# EAGLE schematic boosterpack-can-iso (EAGLE 7.6.0)
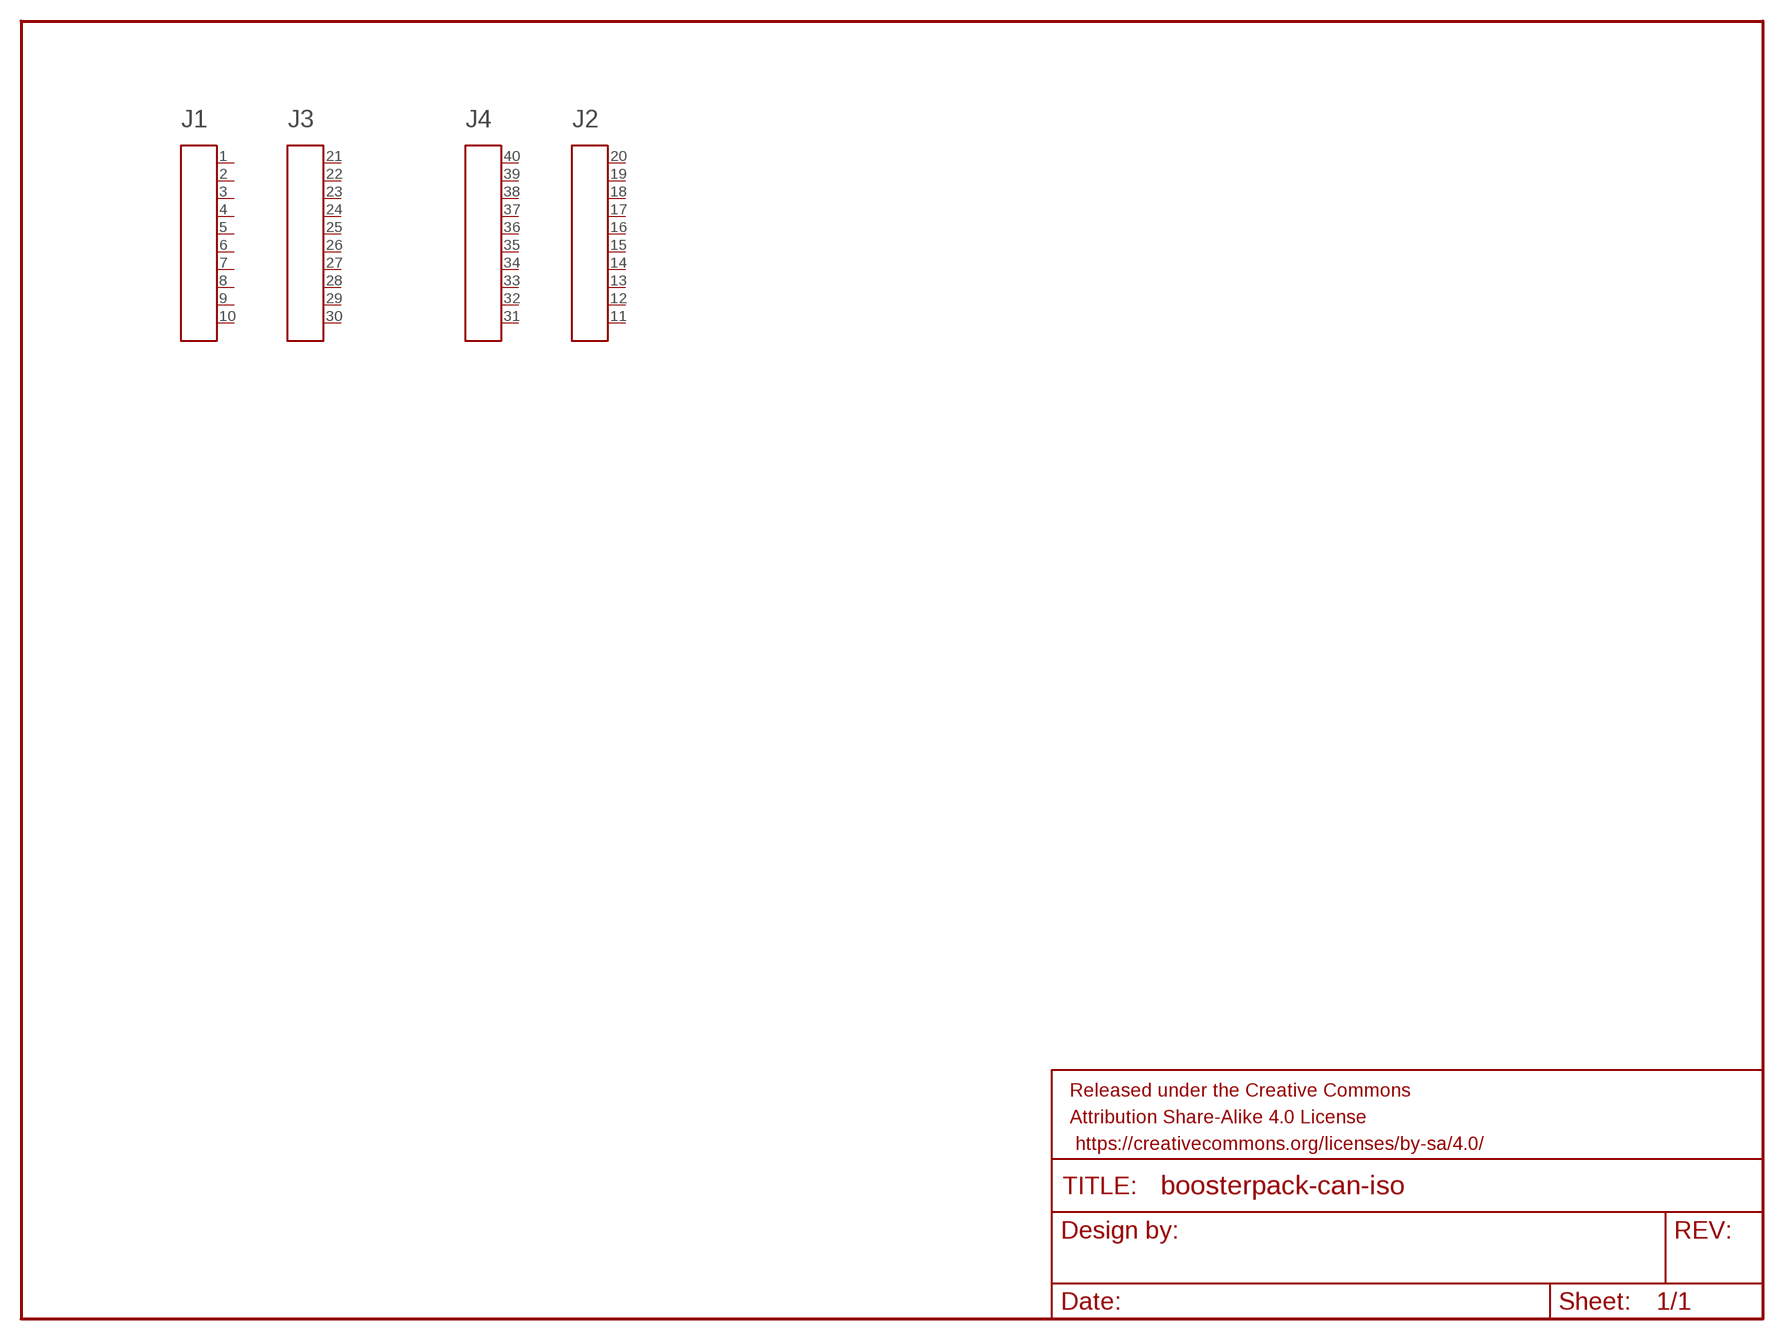
[diagram p0: schematic, sheet 1]

## Parts
A1  HEADER4X10-BOOSTERPACK  [4X10-BOOSTERPACK]
FRAME1  FRAME-LETTERNO_PACKAGE  [DUMMY]
U$1  LOGO-ROCKET  [LOGO-ROCKET]  (not placed on a sheet)
Unconnected: A1.1 A1.2 A1.3 A1.4 A1.5 A1.6 A1.7 A1.8 A1.9 A1.10 A1.11 A1.12 A1.13 A1.14 A1.15 A1.16 A1.17 A1.18 A1.19 A1.20 A1.21 A1.22 A1.23 A1.24 A1.25 A1.26 A1.27 A1.28 A1.29 A1.30 A1.31 A1.32 A1.33 A1.34 A1.35 A1.36 A1.37 A1.38 A1.39 A1.40

## Library data of the parts
A1 = EAGLE_BoosterPack_Library:HEADER4X10-BOOSTERPACK
FRAME1 = SparkFun-Aesthetics:FRAME-LETTER: Schematic Frame Standard 8.5x11 US Letter frame; DESIGNER: Nobody; VERSION: v01
U$1 = EAGLE_BoosterPack_Library:LOGO-ROCKET